# Altium schematic sheet Power&config.SchDoc
size A3
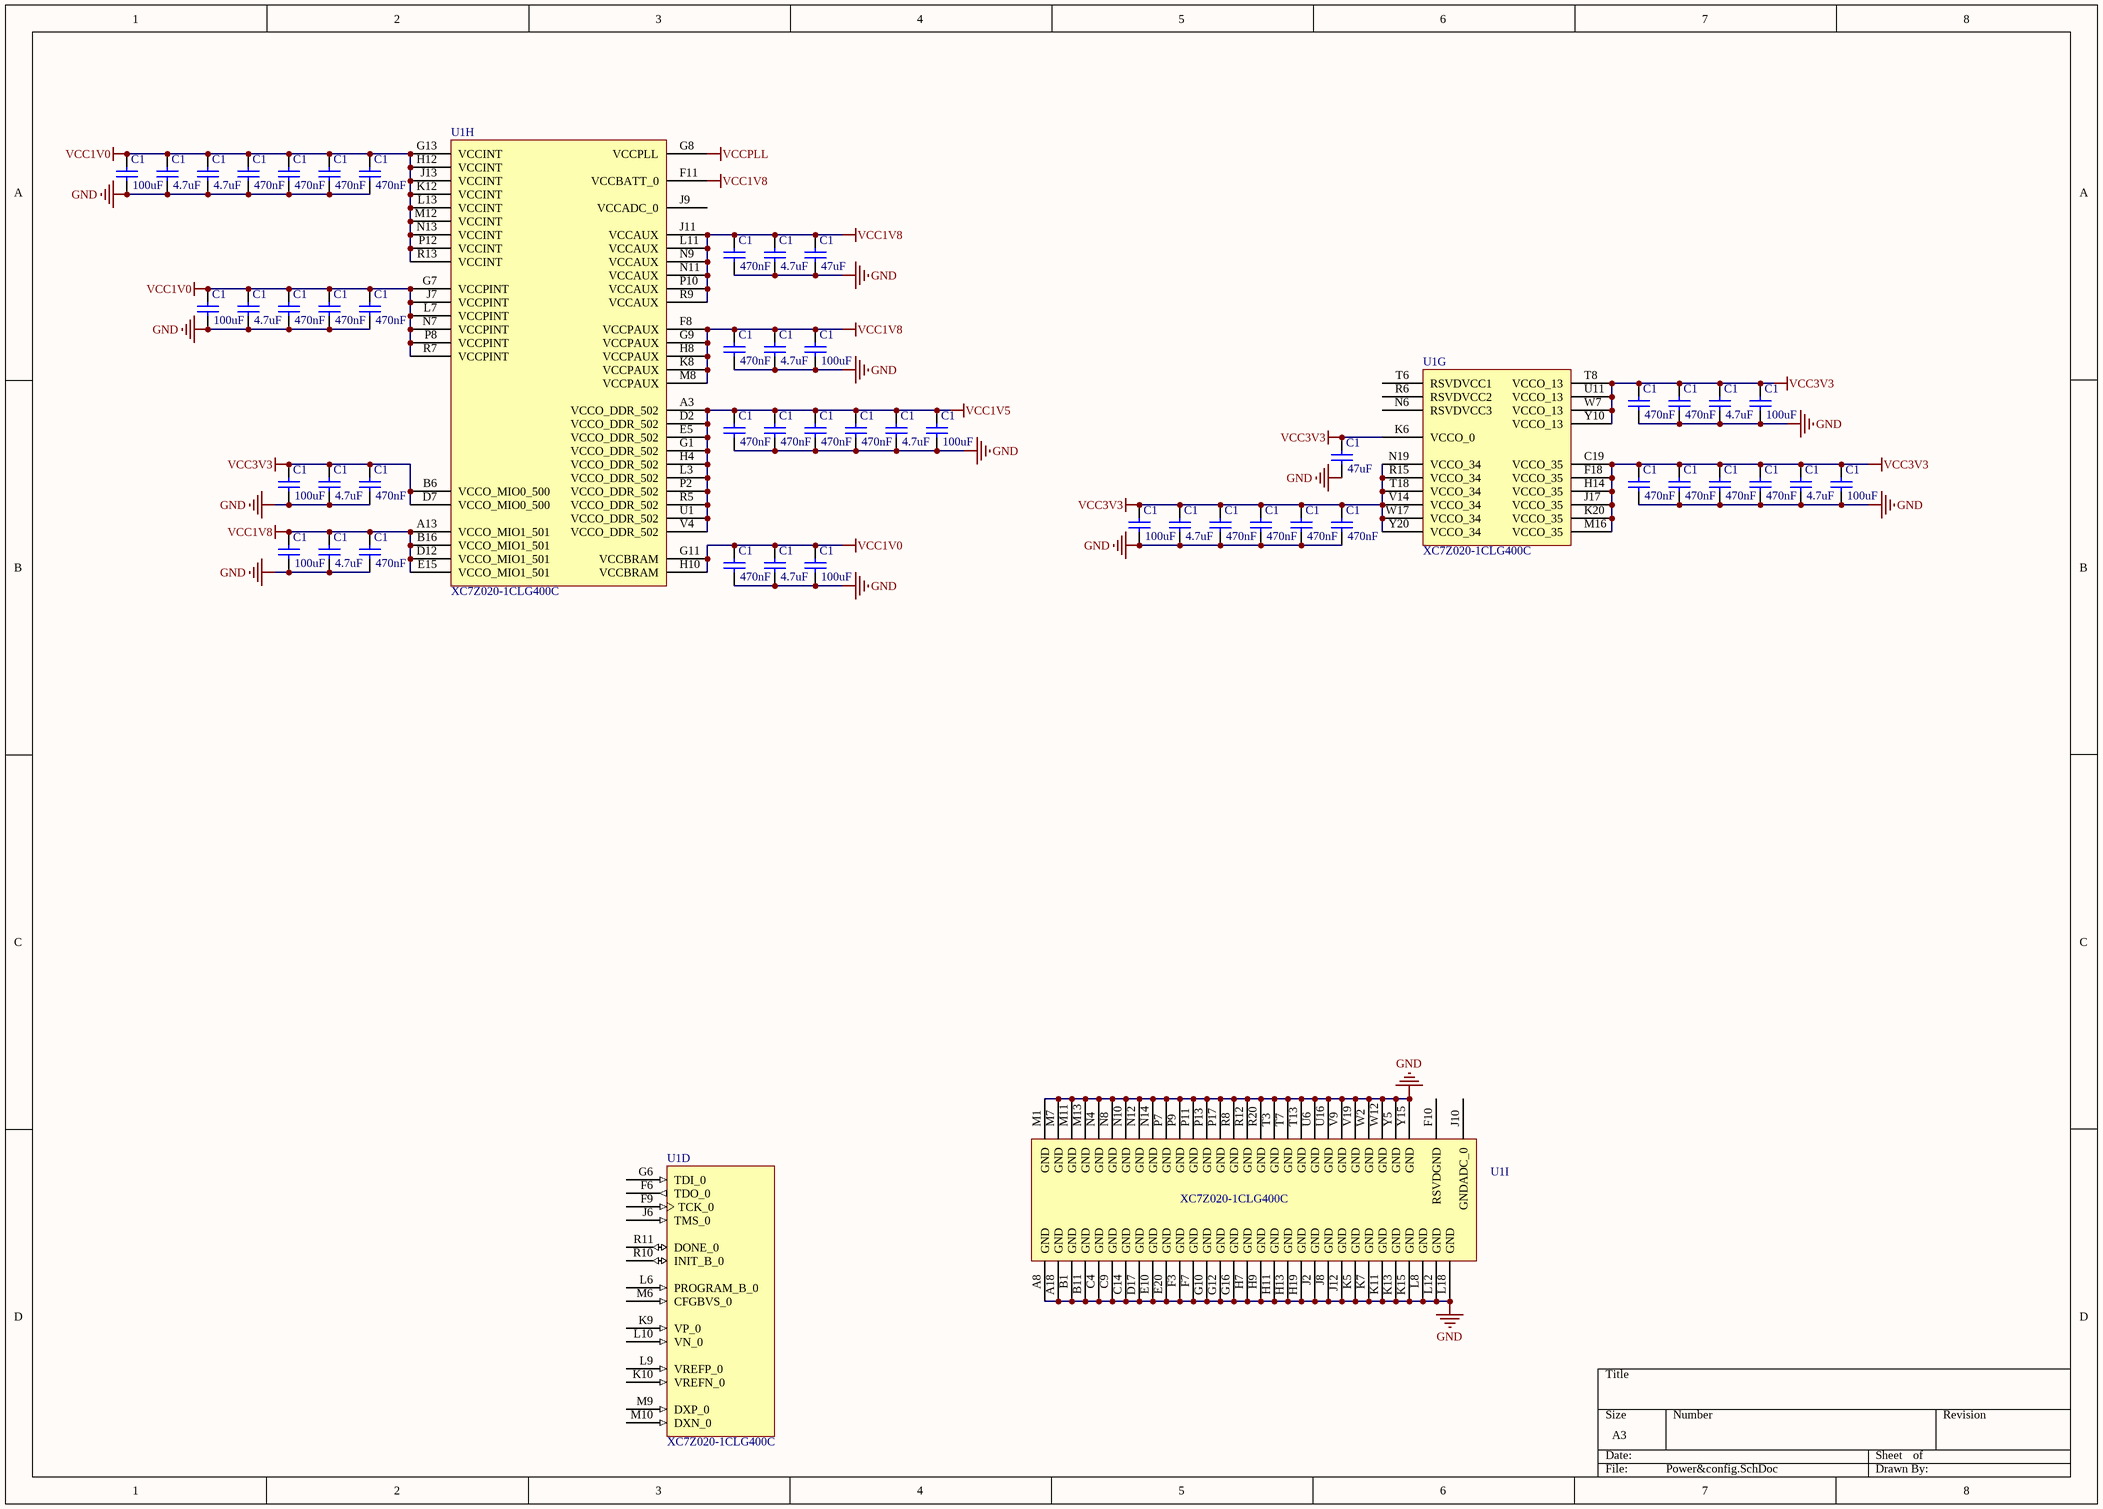
[diagram p0: Power&config.SchDoc]

## Parts
(Parts that share a designator on the sheet are numbered #1, #2 ... from top to bottom, then left to right.)
C1#1  value 100uF  [0402_C]
C1#2  value 4.7uF  [0402_C]
C1#3  value 4.7uF  [0402_C]
C1#4  value 470nF  [0402_C]
C1#5  value 470nF  [0402_C]
C1#6  value 470nF  [0402_C]
C1#7  value 470nF  [0402_C]
C1#8  value 470nF  [0402_C]
C1#9  value 4.7uF  [0402_C]
C1#10  value 47uF  [0402_C]
C1#11  value 100uF  [0402_C]
C1#12  value 4.7uF  [0402_C]
C1#13  value 470nF  [0402_C]
C1#14  value 470nF  [0402_C]
C1#15  value 470nF  [0402_C]
C1#16  value 470nF  [0402_C]
C1#17  value 4.7uF  [0402_C]
C1#18  value 100uF  [0402_C]
C1#19  value 470nF  [0402_C]
C1#20  value 470nF  [0402_C]
C1#21  value 4.7uF  [0402_C]
C1#22  value 100uF  [0402_C]
C1#23  value 470nF  [0402_C]
C1#24  value 470nF  [0402_C]
C1#25  value 470nF  [0402_C]
C1#26  value 470nF  [0402_C]
C1#27  value 4.7uF  [0402_C]
C1#28  value 100uF  [0402_C]
C1#29  value 47uF  [0402_C]
C1#30  value 100uF  [0402_C]
C1#31  value 4.7uF  [0402_C]
C1#32  value 470nF  [0402_C]
C1#33  value 470nF  [0402_C]
C1#34  value 470nF  [0402_C]
C1#35  value 470nF  [0402_C]
C1#36  value 470nF  [0402_C]
C1#37  value 4.7uF  [0402_C]
C1#38  value 100uF  [0402_C]
C1#39  value 100uF  [0402_C]
C1#40  value 4.7uF  [0402_C]
C1#41  value 470nF  [0402_C]
C1#42  value 470nF  [0402_C]
C1#43  value 470nF  [0402_C]
C1#44  value 470nF  [0402_C]
C1#45  value 100uF  [0402_C]
C1#46  value 4.7uF  [0402_C]
C1#47  value 470nF  [0402_C]
C1#48  value 470nF  [0402_C]
C1#49  value 4.7uF  [0402_C]
C1#50  value 100uF  [0402_C]
U1  XC7Z020-1CLG400C  [CLG400]  (parts D,G,H,I of 9)

## Nets
GND: C1#1.1 C1#2.1 C1#3.1 C1#4.1 C1#5.1 C1#6.1 C1#7.1 C1#8.1 C1#9.1 C1#10.1 C1#11.1 C1#12.1 C1#13.1 C1#14.1 C1#15.1 C1#16.1 C1#17.1 C1#18.1 C1#19.1 C1#20.1 C1#21.1 C1#22.1 C1#23.1 C1#24.1 C1#25.1 C1#26.1 C1#27.1 C1#28.1 C1#29.1 C1#30.1 C1#31.1 C1#32.1 C1#33.1 C1#34.1 C1#35.1 C1#36.1 C1#37.1 C1#38.1 C1#39.1 C1#40.1 C1#41.1 C1#42.1 C1#43.1 C1#44.1 C1#45.1 C1#46.1 C1#47.1 C1#48.1 C1#49.1 C1#50.1 U1.A8(GND) U1.A18(GND) U1.B1(GND) U1.B11(GND) U1.C4(GND) U1.C9(GND) U1.C14(GND) U1.D17(GND) U1.E10(GND) U1.E20(GND) U1.F3(GND) U1.F7(GND) U1.G10(GND) U1.G12(GND) U1.G16(GND) U1.H7(GND) U1.H9(GND) U1.H11(GND) U1.H13(GND) U1.H19(GND) U1.J2(GND) U1.J8(GND) U1.J12(GND) U1.K5(GND) U1.K7(GND) U1.K11(GND) U1.K13(GND) U1.K15(GND) U1.L8(GND) U1.L12(GND) U1.L18(GND) U1.M1(GND) U1.M7(GND) U1.M11(GND) U1.M13(GND) U1.N4(GND) U1.N8(GND) U1.N10(GND) U1.N12(GND) U1.N14(GND) U1.P7(GND) U1.P9(GND) U1.P11(GND) U1.P13(GND) U1.P17(GND) U1.R8(GND) U1.R12(GND) U1.R20(GND) U1.T3(GND) U1.T7(GND) U1.T13(GND) U1.U6(GND) U1.U16(GND) U1.V9(GND) U1.V19(GND) U1.W2(GND) U1.W12(GND) U1.Y5(GND) U1.Y15(GND)
VCC1V0: C1#1.2 C1#2.2 C1#3.2 C1#4.2 C1#5.2 C1#6.2 C1#7.2 C1#11.2 C1#12.2 C1#13.2 C1#14.2 C1#15.2 C1#48.2 C1#49.2 C1#50.2 U1.G7(VCCPINT) U1.G11(VCCBRAM) U1.G13(VCCINT) U1.H10(VCCBRAM) U1.H12(VCCINT) U1.J7(VCCPINT) U1.J13(VCCINT) U1.K12(VCCINT) U1.L7(VCCPINT) U1.L13(VCCINT) U1.M12(VCCINT) U1.N7(VCCPINT) U1.N13(VCCINT) U1.P8(VCCPINT) U1.P12(VCCINT) U1.R7(VCCPINT) U1.R13(VCCINT)
VCC1V5: C1#23.2 C1#24.2 C1#25.2 C1#26.2 C1#27.2 C1#28.2 U1.A3(VCCO_DDR_502) U1.D2(VCCO_DDR_502) U1.E5(VCCO_DDR_502) U1.G1(VCCO_DDR_502) U1.H4(VCCO_DDR_502) U1.L3(VCCO_DDR_502) U1.P2(VCCO_DDR_502) U1.R5(VCCO_DDR_502) U1.U1(VCCO_DDR_502) U1.V4(VCCO_DDR_502)
VCC1V8: C1#8.2 C1#9.2 C1#10.2 C1#16.2 C1#17.2 C1#18.2 C1#45.2 C1#46.2 C1#47.2 U1.A13(VCCO_MIO1_501) U1.B16(VCCO_MIO1_501) U1.D12(VCCO_MIO1_501) U1.E15(VCCO_MIO1_501) U1.F8(VCCPAUX) U1.F11(VCCBATT_0) U1.G9(VCCPAUX) U1.H8(VCCPAUX) U1.J11(VCCAUX) U1.K8(VCCPAUX) U1.L11(VCCAUX) U1.M8(VCCPAUX) U1.N9(VCCAUX) U1.N11(VCCAUX) U1.P10(VCCAUX) U1.R9(VCCAUX)
VCC3V3: C1#19.2 C1#20.2 C1#21.2 C1#22.2 C1#29.2 C1#30.2 C1#31.2 C1#32.2 C1#33.2 C1#34.2 C1#35.2 C1#36.2 C1#37.2 C1#38.2 C1#39.2 C1#40.2 C1#41.2 C1#42.2 C1#43.2 C1#44.2 U1.B6(VCCO_MIO0_500) U1.C19(VCCO_35) U1.D7(VCCO_MIO0_500) U1.F18(VCCO_35) U1.H14(VCCO_35) U1.J17(VCCO_35) U1.K6(VCCO_0) U1.K20(VCCO_35) U1.M16(VCCO_35) U1.N19(VCCO_34) U1.R15(VCCO_34) U1.T8(VCCO_13) U1.T18(VCCO_34) U1.U11(VCCO_13) U1.V14(VCCO_34) U1.W7(VCCO_13) U1.W17(VCCO_34) U1.Y10(VCCO_13) U1.Y20(VCCO_34)
VCCPLL: U1.G8(VCCPLL)

Not connected (* = marked no-connect by the designer): U1 F6(TDO_0) F9(TCK_0) F10(RSVDGND) G6(TDI_0) J6(TMS_0) J9(VCCADC_0) J10(GNDADC_0) K9(VP_0) K10(VREFN_0) L6(PROGRAM_B_0) L9(VREFP_0) L10(VN_0) M6(CFGBVS_0) M9(DXP_0) M10(DXN_0) N6(RSVDVCC3) R6(RSVDVCC2) R10(INIT_B_0) R11(DONE_0) T6(RSVDVCC1)

## Library data of the parts
C1#1-C1#50 = Cap: Published: 8-Jun-2000; LatestRevisionDate: 29-May-2009; LatestRevisionNote: IPC-7351 Footprint Added.; PackageReference: C1206; Publisher: Altium Limited; PackageDescription: Chip Capacitor
U1 = XC7Z020-1CLG400C: 667 MHz Zynq?7000 AP SoC, 130 PS I/O, 125 FPGA I/O, 400-Ball BGA, Speed Grade 1, Commercial Grade, Pb-Free; Manufacturer: Xilinx; Extensible Block RAM (# 36Kb Blocks): 560 KB (140); Flip Flops: 106400; LUTs: 53200; Speed Grade: -1; DatasheetVersion: v1.2; PackageVersion: Rev 1.1; PackageReference: CLG400; PackageDescription: Wire-Bond Chip-Scale BGA, Body 17 x 17 mm, 0.8 mm Pitch; Generic Part Number: XC7Z020; RoHS: Pb-Free; Mounting Technology: Surface Mount; Code_JEDEC: MO-275-MMAA-1; PartNumber: XC7Z020-1CLG400C; ComponentLink1Description: Datasheet; ComponentLink1URL: http://www.xilinx.com/support/documentation/data_sheets/ds190-Zynq-7000-Overview.pdf; ComponentLink2Description: Package Specification; ComponentLink2URL: http://www.xilinx.com/support/documentation/user_guides/ug865-Zynq-7000-Pkg-Pinout.pdf; ComponentLink3Description: DC and AC Switching Characteristics; ComponentLink3URL: http://www.xilinx.com/support/documentation/data_sheets/ds187-XC7Z010-XC7Z020-Data-Sheet.pdf; ComponentLink4Description: Package File; ComponentLink4URL: http://www.xilinx.com/support/packagefiles/z7packages/xc7z020clg400pkg.txt; ComponentLink5Description: Packaging and Pinout; ComponentLink5URL: http://www.xilinx.com/support/documentation/user_guides/ug865-Zynq-7000-Pkg-Pinout.pdf; ComponentLink6Description: PCB and Layout Guide; ComponentLink6URL: http://www.xilinx.com/support/documentation/user_guides/ug483_7Series_PCB.pdf